# EAGLE schematic IR_Controller_ESP32_Layout (EAGLE 9.6.2)
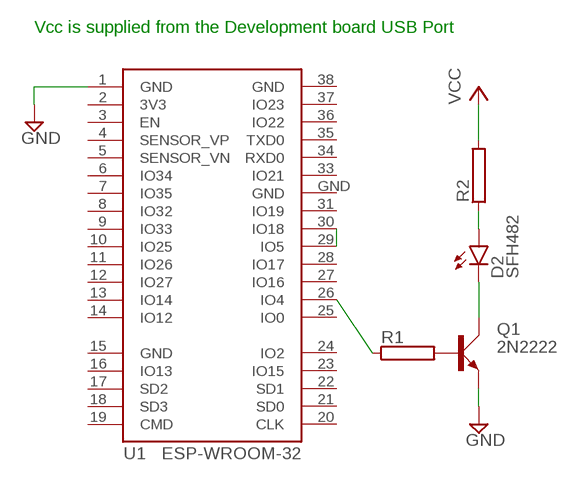
[diagram p0: schematic, sheet 1]

## Parts
D2  SFH482  [SFH482]
Q1  2N2222  [TO18A]
R1  RAC01  [AC01]
R2  RAC01  [AC01]
U1  ESP-WROOM-32  [ESP-WROOM-32]

## Nets
GND: Q1.E U1.1(GND)
N$1: D2.A R2.1
N$2: R1.1 U1.26(IO4)
N$3: U1.29(IO5) U1.30(IO18)
N$4: Q1.B R1.2
N$6: D2.K(C) Q1.C
VCC: R2.2
Unconnected: U1.3(EN) U1.4(SENSOR_VP) U1.5(SENSOR_VN) U1.6(IO34) U1.7(IO35) U1.8(IO32) U1.9(IO33) U1.10(IO25) U1.11(IO26) U1.12(IO27) U1.13(IO14) U1.14(IO12) U1.16(IO13) U1.17(SD2) U1.18(SD3) U1.19(CMD) U1.20(CLK) U1.21(SD0) U1.22(SD1) U1.23(IO15) U1.24(IO2) U1.25(IO0) U1.27(IO16) U1.28(IO17) U1.31(IO19) U1.33(IO21) U1.34(RXD0) U1.35(TXD0) U1.36(IO22) U1.37(IO23)

## Notes on the sheet
- Vcc is supplied from the Development board USB Port

## Power pins joined to a net without a drawn wire
3V3: U1.2(3V3)
GND: U1.15(GND) U1.38(GND) U1.GND

## Library data of the parts
D2 = led:SFH482: IR LED infrared emitting diode, Infineon
Q1 = transistor-small-signal:2N2222: NPN TRANSISTOR
R1 R2 = resistor-power:R: Power Resitor; OC_FARNELL: unknown; OC_NEWARK: unknown
U1 = ESP32_Lib:ESP-WROOM-32: Espressif Systems ESP-WROOM-32